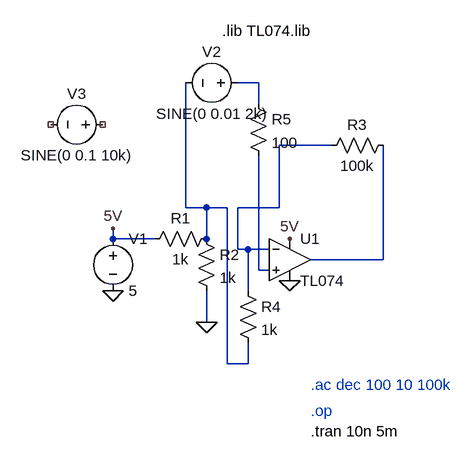
[diagram p0: schematic piezoamp.asc]
piezoamp.asc, the LTspice schematic file:
Version 4
SHEET 1 880 1696
WIRE -224 1104 -256 1104
WIRE -224 1136 -224 1104
WIRE -112 1200 -192 1200
WIRE -336 1296 -336 1104
WIRE -304 1296 -336 1296
WIRE -272 1296 -304 1296
WIRE -192 1296 -192 1200
WIRE -192 1296 -256 1296
WIRE -448 1344 -448 1328
WIRE -384 1344 -448 1344
WIRE -304 1344 -304 1296
WIRE -256 1360 -256 1296
WIRE -240 1360 -256 1360
WIRE -208 1360 -240 1360
WIRE -32 1376 -32 1200
WIRE -32 1376 -144 1376
WIRE -224 1392 -224 1216
WIRE -208 1392 -224 1392
WIRE -240 1424 -240 1360
WIRE -304 1472 -304 1424
WIRE -272 1536 -272 1296
WIRE -240 1536 -240 1504
WIRE -240 1536 -272 1536
FLAG -448 1424 0
FLAG -176 1408 0
FLAG -304 1472 0
FLAG -176 1344 5V
FLAG -448 1328 5V
SYMBOL voltage -448 1328 R0
SYMATTR InstName V1
SYMATTR Value 5
SYMBOL OpAmps/opamp2 -176 1312 R0
SYMATTR InstName U1
SYMATTR Value TL074
SYMBOL Res -400 1360 R270
WINDOW 0 32 56 VTop 2
WINDOW 3 0 56 VBottom 2
SYMATTR InstName R1
SYMATTR Value 1k
SYMBOL Res -320 1328 R0
SYMATTR InstName R2
SYMATTR Value 1k
SYMBOL voltage -240 1104 R90
WINDOW 0 -32 56 VBottom 2
WINDOW 3 32 56 VTop 2
SYMATTR InstName V2
SYMATTR Value SINE(0 0.01 2k)
SYMBOL Res -16 1184 R90
WINDOW 0 0 56 VBottom 2
WINDOW 3 32 56 VTop 2
SYMATTR InstName R3
SYMATTR Value 100k
SYMBOL voltage -448 1168 R90
WINDOW 0 -32 56 VBottom 2
WINDOW 3 32 56 VTop 2
SYMATTR InstName V3
SYMATTR Value SINE(0 0.1 10k)
SYMBOL Res -256 1408 R0
SYMATTR InstName R4
SYMATTR Value 1k
SYMBOL Res -240 1120 R0
SYMATTR InstName R5
SYMATTR Value 100
TEXT -144 1568 Left 2 ;.ac dec 100 10 100k
TEXT -144 1608 Left 2 ;.op
TEXT -144 1640 Left 2 !.tran 10n 5m
TEXT -280 1024 Left 2 !.lib TL074.lib

The netlist it stands for:
* piezoamp.asc
V1 5V 0 5
XU1 N005 N002 5V 0 N004 TL074  ; pins In+ In- V+ V- OUT
R1 5V N003 1k
R2 N003 0 1k
V2 N001 N003 SINE(0 0.01 2k)
R3 N004 N002 100k
V3 NC_01 NC_02 SINE(0 0.1 10k)
R4 N002 N003 1k
R5 N001 N005 100
* .ac dec 100 10 100k
* .op
.tran 10n 5m
.lib TL074.lib
.backanno
.end